# Altium schematic sheet Clock Synth.SchDoc: Clock Synthesizer
size Tabloid; ApprovedBy: NA; CompanyName: Cospan Design LLC; DrawnBy: Dave McCoy; Engineer: Dave McCoy; DocumentNumber: 6; Revision: A; SheetNumber: 6; SheetTotal: 20; Client: Public; Project: Enigma; ProjectPrettyName: Enigma
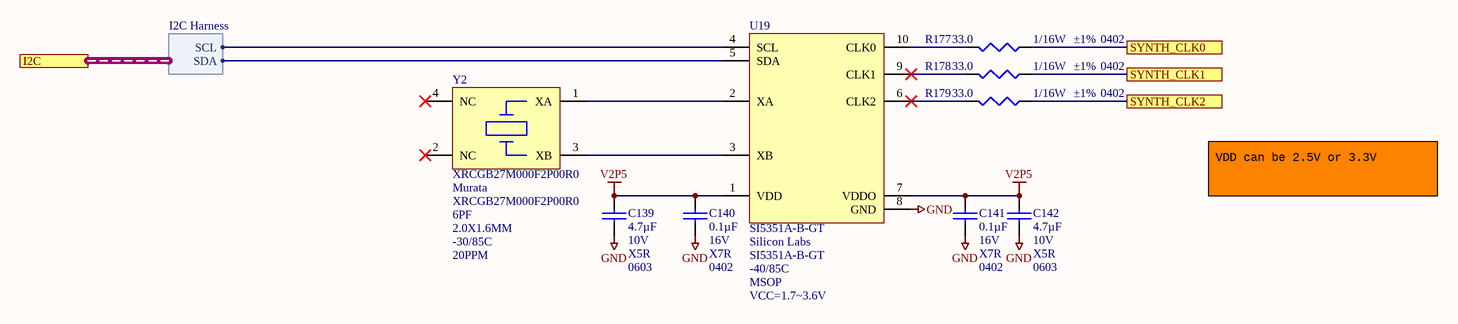
[diagram p0: Clock Synth.SchDoc]

## Parts
C139  Voltage - Rated: 10V  Temperature Coefficient: X5R  Package / Case: 0603  [C_ERA-0603]  (hidden comment: 4.7µF)
C140  Capacitance: 0.1µF  Voltage - Rated: 16V  Temperature Coefficient: X7R  Package / Case: 0402  [C_0402]  (hidden comment: 0.1uF)
C141  Capacitance: 0.1µF  Voltage - Rated: 16V  Temperature Coefficient: X7R  Package / Case: 0402  [C_0402]  (hidden comment: 0.1uF)
C142  Voltage - Rated: 10V  Temperature Coefficient: X5R  Package / Case: 0603  [C_ERA-0603]  (hidden comment: 4.7µF)
R177  Resistance In Ohms: 33.0  Power (Watts): 1/16W  Case: 0402  Tolerance: ±1%  [R_0402]  (hidden comment: R_0402_33)
R178  Resistance In Ohms: 33.0  Power (Watts): 1/16W  Case: 0402  Tolerance: ±1%  [R_0402]  (hidden comment: R_0402_33)
R179  Resistance In Ohms: 33.0  Power (Watts): 1/16W  Case: 0402  Tolerance: ±1%  [R_0402]  (hidden comment: R_0402_33)
U19  SI5351A-B-GT  Manufacturer: Silicon Labs  TEMPERATURE: -40/85C  FOOTPRINT: MSOP  VOLTS: VCC=1.7~3.6V  [SI5351]
Y2  XRCGB27M000F2P00R0  Manufacturer: Murata  CAPACITANCE: 6PF  FOOTPRINT: 2.0X1.6MM  TEMPERATURE: -30/85C  TOLERANCE: 20PPM  [XTAL_2.0X1.6MM]

## Ports
I2C (harness I2C Harness), SYNTH_CLK0, SYNTH_CLK1, SYNTH_CLK2

## Harnesses
I2C Harness: SCL, SDA

## Nets
GND: C139.1 C140.1 C141.1 C142.1 U19.8(GND)
V2P5: C139.2 C140.2 C141.2 C142.2 U19.1(VDD) U19.7(VDDO)
SYNTH_CLK0: R177.2 ; port SYNTH_CLK0
SYNTH_CLK1: R178.2 ; port SYNTH_CLK1
SYNTH_CLK2: R179.2 ; port SYNTH_CLK2
NetR177_1: R177.1 U19.10(CLK0)
NetR178_1: R178.1 U19.9(CLK1)
NetR179_1: R179.1 U19.6(CLK2)
NetU19_2: U19.2(XA) Y2.1(XA)
NetU19_3: U19.3(XB) Y2.3(XB)
NetU19_4: U19.4(SCL) ; port I2C.SCL
NetU19_5: U19.5(SDA) ; port I2C.SDA

Not connected (* = marked no-connect by the designer): Y2 2(NC)* 4(NC)*

## Notes on the sheet
- VDD can be 2.5V or 3.3V
- Project:
- http://www.cospandesign.com
- Cospan Design
- Document:
- Engineer:
- Title:
- Client:
- Approved By:
- Revision:
- Date:
- Number:
- of

## Library data of the parts
C139 C142 = C_0603_4.7uF_10V: CAP CER 4.7UF 10V X5R 0603; Manufacturer: Murata Electronics North America; Manufacturer Part Number: GRM188R61A475KE15D; Tolerance: ±10%; Supplier 1: Digi-Key; RoHS: RoHS Compliant; Category: Capacitors; Stock 1: 163304; Pricing 1: 1=0.15, 10=0.105, 100=0.0495, 500=0.03472, 1000=0.02875 (USD); Mounting Type: Surface Mount, MLCC; Operating Temperature: -55°C ~ 85°C; Features: Derating Recommended; Applications: General Purpose; Ratings: -; Size / Dimension: 0.063" L x 0.032" W (1.60mm x 0.80mm); Lead Spacing: -; Packaging: Cut Tape (CT); Lead Style: -; ComponentLink1URL: http://search.murata.co.jp/Ceramy/image/img/A01X/G101/ENG/GRM188R61A475KE15-01.pdf; ComponentLink1Description: http://search.murata.co.jp/Ceramy/image/img/A01X/G101/ENG/GRM188R61A475KE15-01.pdf; Supplier Part Number 1: 490-10477-1-ND; Capacitance: 4.7µF; Part Status: Active; Height - Seated (Max): -; Thickness (Max): 0.039" (1.00mm)
C140 C141 = C_0402_0.1UF_16V: CAP CER .10UF 16V X7R 0402; Manufacturer: Murata Electronics North America; Manufacturer Part Number: GRM155R71C104KA88J; Tolerance: ±10%; Description: CAP CER 0.1UF 16V X7R 0402; Supplier 1: Digi-Key; Supplier Part Number 1: 490-6328-1-ND; RoHS: RoHS Compliant; Category: Capacitors; Stock 1: 18103134; Mounting Type: Surface Mount, MLCC; Features: -; Lead Spacing: -; Packaging: Cut Tape (CT); ComponentLink1URL: http://www.murata.com/~/media/webrenewal/support/library/catalog/products/capacitor/mlcc/c02e.ashx?la=en-us; ComponentLink1Description: http://www.murata.com/~/media/webrenewal/support/library/catalog/products/capacitor/mlcc/c02e.ashx?la=en-us; Operating Temperature: -55°C ~ 125°C; Pricing 1: 1=0.1, 10=0.014, 100=0.0062, 500=0.00442, 1000=0.00348, 2500=0.00316, 5000=0.00291 (USD); Part Status: Active; Ratings: -; Applications: General Purpose; Size / Dimension: 0.039" L x 0.020" W (1.00mm x 0.50mm); Height - Seated (Max): -; Thickness (Max): 0.022" (0.55mm)
R177-R179 = R_0402_33: RES 33.0 OHM 1/16W 1% 0402 SMD; Manufacturer: Yageo; Manufacturer Part Number: RC0402FR-0733RL; Resistance (Ohms): 33; Temperature Coefficient: ±100ppm/°C; Supplier 1: Digi-Key; Supplier Part Number 1: 311-33.0LRCT-ND; RoHS: RoHS Compliant; Category: Resistors; Stock 1: 733920; Pricing: 10=0.014, 50=0.0104, 100=0.0079, 250=0.00584, 500=0.00432, 1000=0.00288 (USD); Composition: Thick Film; Features: -; Size / Dimension: 0.039" L x 0.020" W (1.00mm x 0.50mm); Height: 0.014" (0.35mm); Number of Terminations: 2; Packaging: Cut Tape (CT); Package / Case: 0402 (1005 Metric); ComponentLink1URL: http://www.yageo.com/documents/recent/PYu-RC0402_51_RoHS_L_6.pdf; ComponentLink1Description: http://www.yageo.com/documents/recent/PYu-RC0402_51_RoHS_L_6.pdf
U19 = U_SI5351: IC CLK GENERATOR 200MHZ 10MSOP; PLL: Yes; Input: Crystal; Output: LVCMOS; Ratio - Input:Output: 1:3; Differential - Input:Output: No/No; Divider/Multiplier: Yes/No; Voltage - Supply: 1.71 V ~ 3.6 V; Supplier 1: Digi-Key; Manufacturer Part Number: SI5351A-B-GT; RoHS: RoHS Compliant; Category: Integrated Circuits (ICs); Stock 1: 2160; Pricing 1: 1=0.92, 25=0.8816, 100=0.8475 (USD); Packaging: Cut Tape (CT); Part Status: Active; Type: Clock Generator; Frequency - Max: 200MHz; Operating Temperature: -40°C ~ 85°C; Mounting Type: Surface Mount; Package / Case: 10-TFSOP, 10-MSOP (0.118", 3.00mm Width); Supplier Device Package: 10-MSOP; ComponentLink1URL: http://www.silabs.com/documents/public/data-sheets/Si5351-B.pdf; ComponentLink1Description: http://www.silabs.com/documents/public/data-sheets/Si5351-B.pdf; Supplier Part Number 1: 336-3908-1-ND
Y2 = Y_XTAL_27MHZ_SMD: XTAL 27.00 MHZ 6PF 150OHM 20PPM 2.0X1.6MM; Frequency: 27MHz; Operating Mode: Fundamental; ESR: ESR=150OHMS; Supplier 1: Digi-Key; RoHS: RoHS Compliant; Category: Crystals and Oscillators; Stock 1: 2678; Pricing 1: 1=0.6, 10=0.5, 50=0.4484, 100=0.399, 500=0.38, 1000=0.3192 (USD); Packaging: Cut Tape (CT); Part Status: Active; Type: MHz Crystal; Frequency Stability: ±20ppm; Frequency Tolerance: ±20ppm; Load Capacitance: 6pF; ESR (Equivalent Series Resistance): 150 Ohm; Operating Temperature: -30°C ~ 85°C; Ratings: -; Mounting Type: Surface Mount; Package / Case: 4-SMD, No Lead (DFN, LCC); Size / Dimension: 0.079" L x 0.063" W (2.00mm x 1.60mm); Height: 0.028" (0.70mm); ComponentLink1URL: http://www.murata.com/~/media/webrenewal/support/library/catalog/products/timingdevice/crystalu/p79e.ashx; ComponentLink1Description: http://www.murata.com/~/media/webrenewal/support/library/catalog/products/timingdevice/crystalu/p79e.ashx; Supplier Part Number 1: 490-9765-1-ND; Manufacturer Part Number: XRCGB27M000F2P00R0